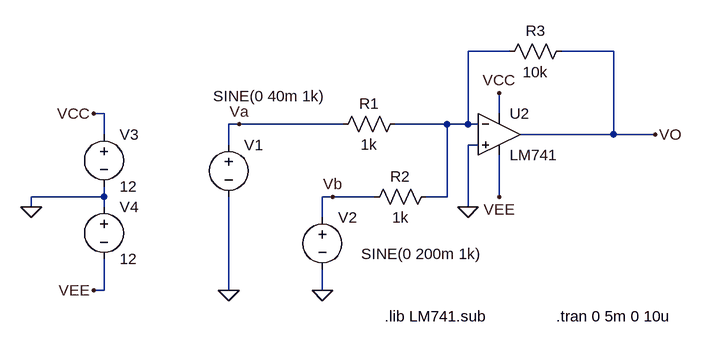
[diagram p0: schematic SumadordeTension.asc]
SumadordeTension.asc, the LTspice schematic file:
Version 4
SHEET 1 880 680
WIRE 384 160 320 160
WIRE 544 160 464 160
WIRE -240 256 -256 256
WIRE 368 256 368 224
WIRE -32 272 -48 272
WIRE 128 272 -32 272
WIRE 288 272 208 272
WIRE 320 272 320 160
WIRE 320 272 288 272
WIRE 336 272 320 272
WIRE -240 288 -240 256
WIRE 544 288 544 160
WIRE 544 288 400 288
WIRE 608 288 544 288
WIRE -48 304 -48 272
WIRE 336 304 320 304
WIRE -240 384 -240 368
WIRE -240 384 -352 384
WIRE 112 384 96 384
WIRE 176 384 112 384
WIRE 288 384 288 272
WIRE 288 384 256 384
WIRE 368 384 368 320
WIRE -352 400 -352 384
WIRE -240 400 -240 384
WIRE 320 400 320 304
WIRE 96 416 96 384
WIRE -240 528 -240 480
WIRE -240 528 -256 528
WIRE -48 528 -48 384
WIRE 96 528 96 496
FLAG 320 400 0
FLAG 96 528 0
FLAG -48 528 0
FLAG -352 400 0
FLAG -256 528 VEE
FLAG -256 256 VCC
FLAG 368 384 VEE
FLAG 368 224 VCC
FLAG 608 288 VO
FLAG -32 272 Va
FLAG 112 384 Vb
SYMBOL res 224 256 R90
WINDOW 0 0 56 VBottom 2
WINDOW 3 32 56 VTop 2
SYMATTR InstName R1
SYMATTR Value 1k
SYMBOL res 272 368 R90
WINDOW 0 0 56 VBottom 2
WINDOW 3 32 56 VTop 2
SYMATTR InstName R2
SYMATTR Value 1k
SYMBOL res 480 144 R90
WINDOW 0 0 56 VBottom 2
WINDOW 3 32 56 VTop 2
SYMATTR InstName R3
SYMATTR Value 10k
SYMBOL voltage -48 288 R0
WINDOW 3 -24 -59 Left 2
SYMATTR InstName V1
SYMATTR Value SINE(0 40m 1k)
SYMBOL voltage 96 400 R0
WINDOW 3 60 72 Left 2
SYMATTR InstName V2
SYMATTR Value SINE(0 200m 1k)
SYMBOL voltage -240 272 R0
SYMATTR InstName V3
SYMATTR Value 12
SYMBOL voltage -240 384 R0
SYMATTR InstName V4
SYMATTR Value 12
SYMBOL opamp2 368 224 R0
SYMATTR InstName U2
SYMATTR Value LM741
TEXT 192 568 Left 2 !.lib LM741.sub
TEXT 456 568 Left 2 !.tran 0 5m 0 10u

The netlist it stands for:
* SumadordeTension.asc
R1 N001 Va 1k
R2 N001 Vb 1k
R3 VO N001 10k
V1 Va 0 SINE(0 40m 1k)
V2 Vb 0 SINE(0 200m 1k)
V3 VCC 0 12
V4 0 VEE 12
XU2 0 N001 VCC VEE VO LM741  ; pins In+ In- V+ V- OUT
.lib LM741.sub
.tran 0 5m 0 10u
.backanno
.end